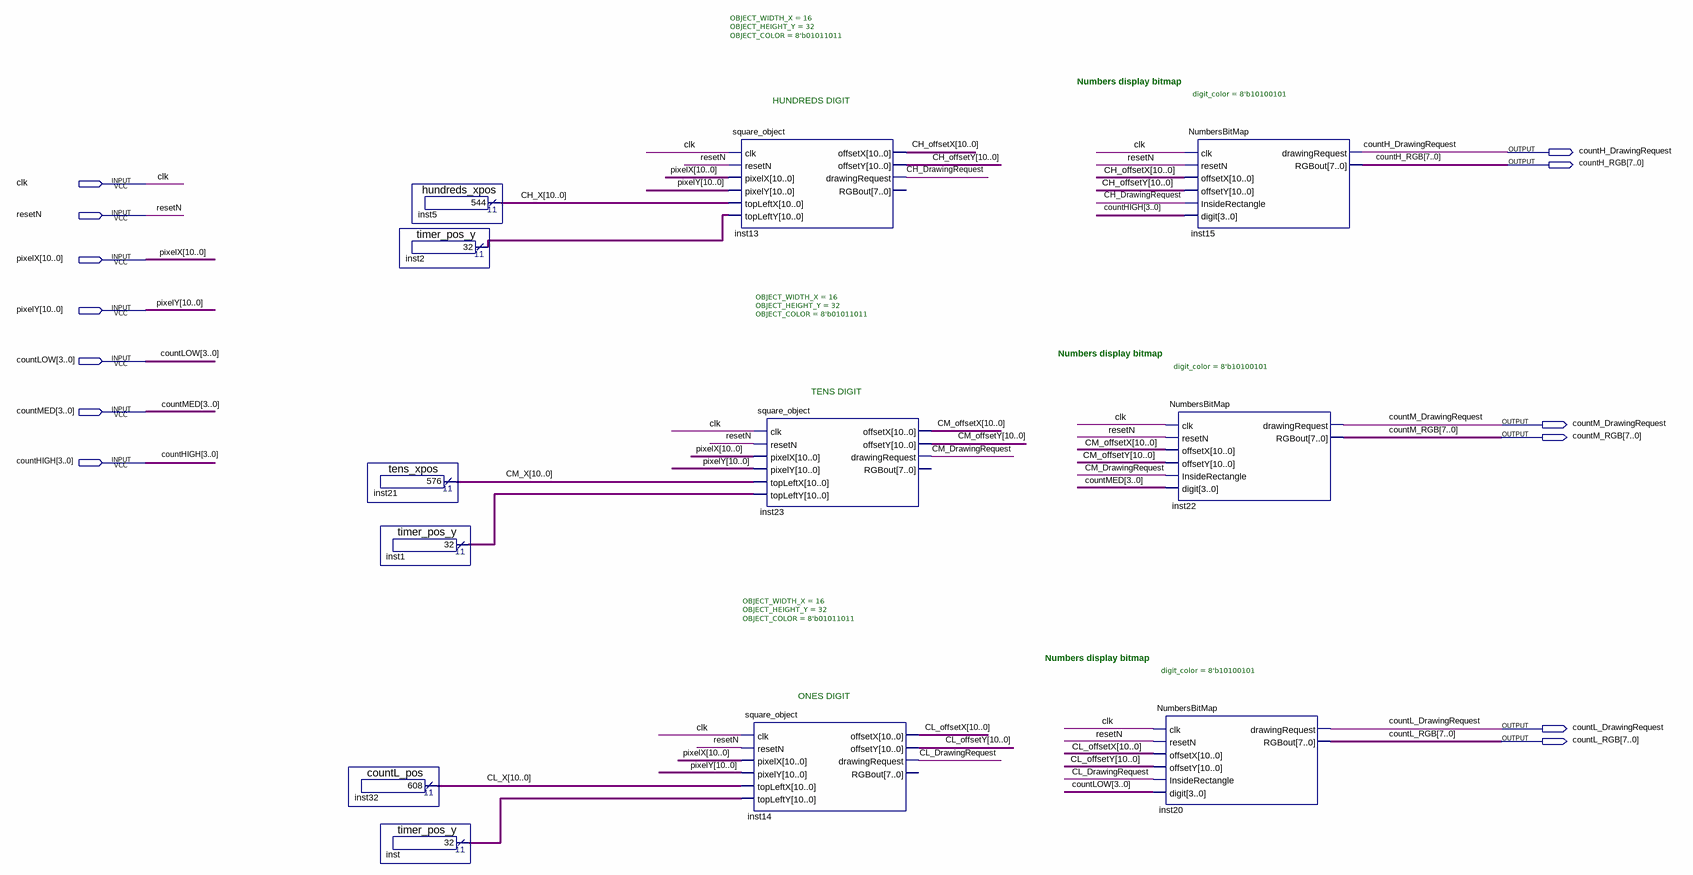
[diagram p0: schematic sheet]
// Quartus schematic TIMER_DISPLAY.bdf as structural Verilog: 12 symbols, 13 pins
module TIMER_DISPLAY (
  input  clk,
  input  resetN,
  input  [10:0] pixelX,
  input  [10:0] pixelY,
  input  [3:0] countLOW,
  input  [3:0] countMED,
  input  [3:0] countHIGH,
  output countH_DrawingRequest,
  output [7:0] countH_RGB,
  output countM_DrawingRequest,
  output [7:0] countM_RGB,
  output countL_DrawingRequest,
  output [7:0] countL_RGB
);

  wire CH_DrawingRequest, CL_DrawingRequest, CM_DrawingRequest;
  wire [10:0] CH_offsetX, CH_offsetY, CH_X, CL_offsetX, CL_offsetY, CL_X, CM_offsetX, CM_offsetY, CM_X,
       inst1_result, inst2_result, inst_result;

  tens_xpos inst21 (.result(CM_X));
  timer_pos_y inst1 (.result(inst1_result));
  countL_pos inst32 (.result(CL_X));
  timer_pos_y inst (.result(inst_result));
  hundreds_xpos inst5 (.result(CH_X));
  timer_pos_y inst2 (.result(inst2_result));
  square_object #(.OBJECT_WIDTH_X(16), .OBJECT_HEIGHT_Y(32), .OBJECT_COLOR(8'b01011011)) inst13 (
    .clk(clk), .resetN(resetN), .pixelX(pixelX), .pixelY(pixelY), .topLeftX(CH_X), .topLeftY(inst2_result),
    .offsetX(CH_offsetX), .offsetY(CH_offsetY), .drawingRequest(CH_DrawingRequest));  // open: RGBout
  square_object #(.OBJECT_WIDTH_X(16), .OBJECT_HEIGHT_Y(32), .OBJECT_COLOR(8'b01011011)) inst23 (
    .clk(clk), .resetN(resetN), .pixelX(pixelX), .pixelY(pixelY), .topLeftX(CM_X), .topLeftY(inst1_result),
    .offsetX(CM_offsetX), .offsetY(CM_offsetY), .drawingRequest(CM_DrawingRequest));  // open: RGBout
  square_object #(.OBJECT_WIDTH_X(16), .OBJECT_HEIGHT_Y(32), .OBJECT_COLOR(8'b01011011)) inst14 (
    .clk(clk), .resetN(resetN), .pixelX(pixelX), .pixelY(pixelY), .topLeftX(CL_X), .topLeftY(inst_result),
    .offsetX(CL_offsetX), .offsetY(CL_offsetY), .drawingRequest(CL_DrawingRequest));  // open: RGBout
  NumbersBitMap #(.digit_color(8'b10100101)) inst15 (
    .clk(clk), .resetN(resetN), .offsetX(CH_offsetX), .offsetY(CH_offsetY),
    .InsideRectangle(CH_DrawingRequest), .digit(countHIGH), .drawingRequest(countH_DrawingRequest),
    .RGBout(countH_RGB));
  NumbersBitMap #(.digit_color(8'b10100101)) inst22 (
    .clk(clk), .resetN(resetN), .offsetX(CM_offsetX), .offsetY(CM_offsetY),
    .InsideRectangle(CM_DrawingRequest), .digit(countMED), .drawingRequest(countM_DrawingRequest),
    .RGBout(countM_RGB));
  NumbersBitMap #(.digit_color(8'b10100101)) inst20 (
    .clk(clk), .resetN(resetN), .offsetX(CL_offsetX), .offsetY(CL_offsetY),
    .InsideRectangle(CL_DrawingRequest), .digit(countLOW), .drawingRequest(countL_DrawingRequest),
    .RGBout(countL_RGB));

  // Notes on the sheet:
  //   Numbers display bitmap
  //   HUNDREDS DIGIT
  //   Numbers display bitmap
  //   TENS DIGIT
  //   Numbers display bitmap
  //   ONES DIGIT
endmodule
